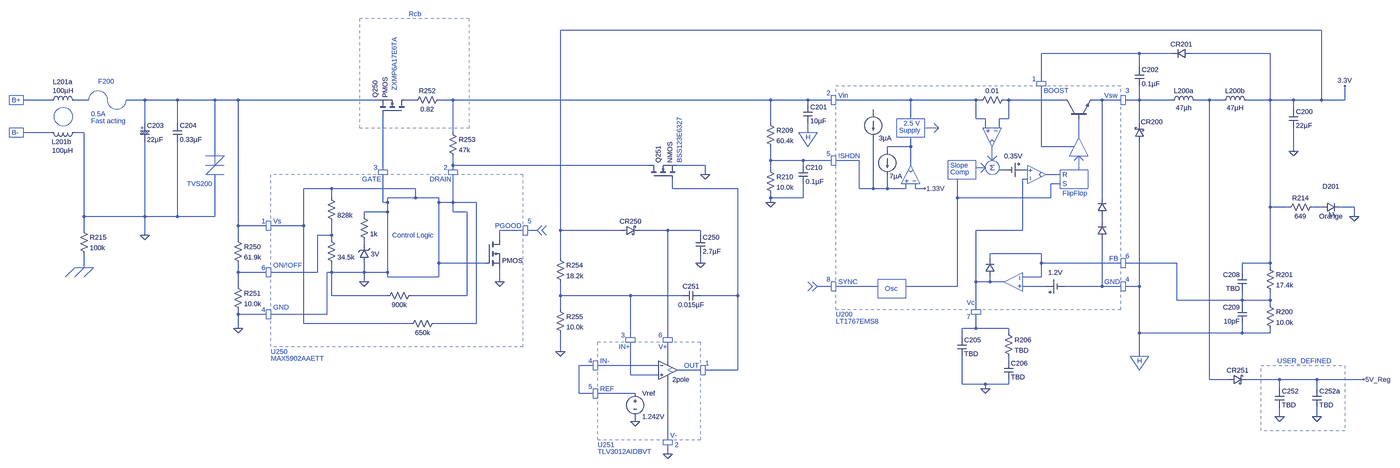
[diagram p0: schematic SPS_rev2_2.asc, whole sheet]
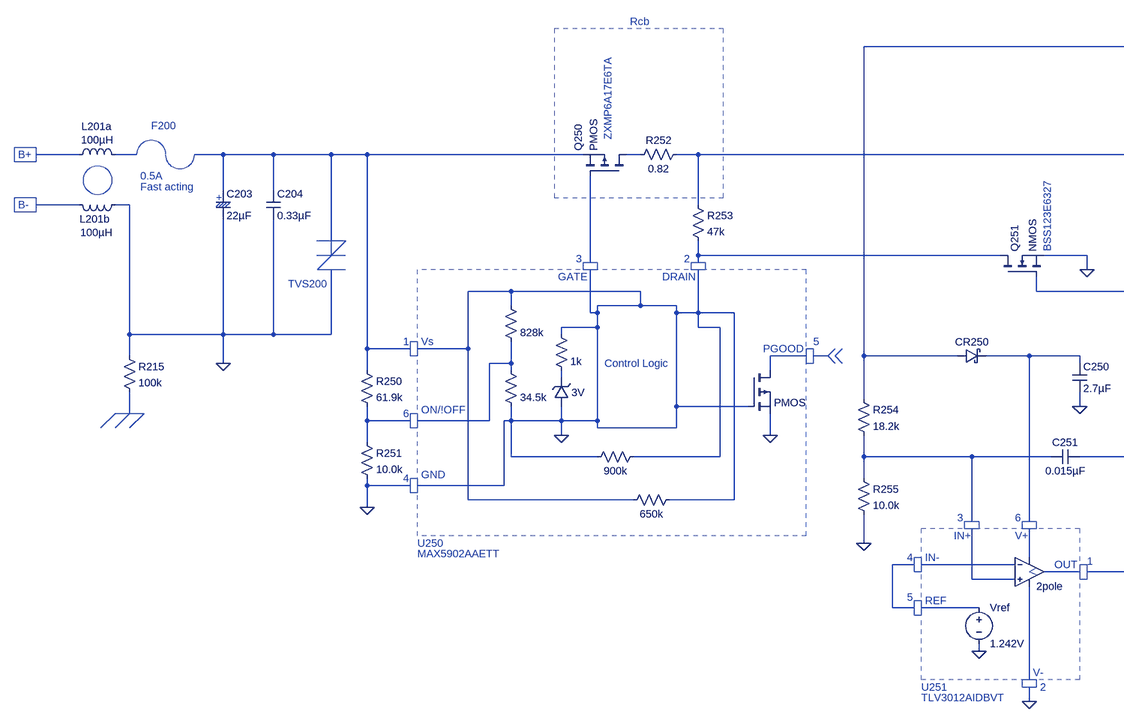
[diagram p1: schematic SPS_rev2_2.asc, part, row 1 of 1, column 1 of 2]
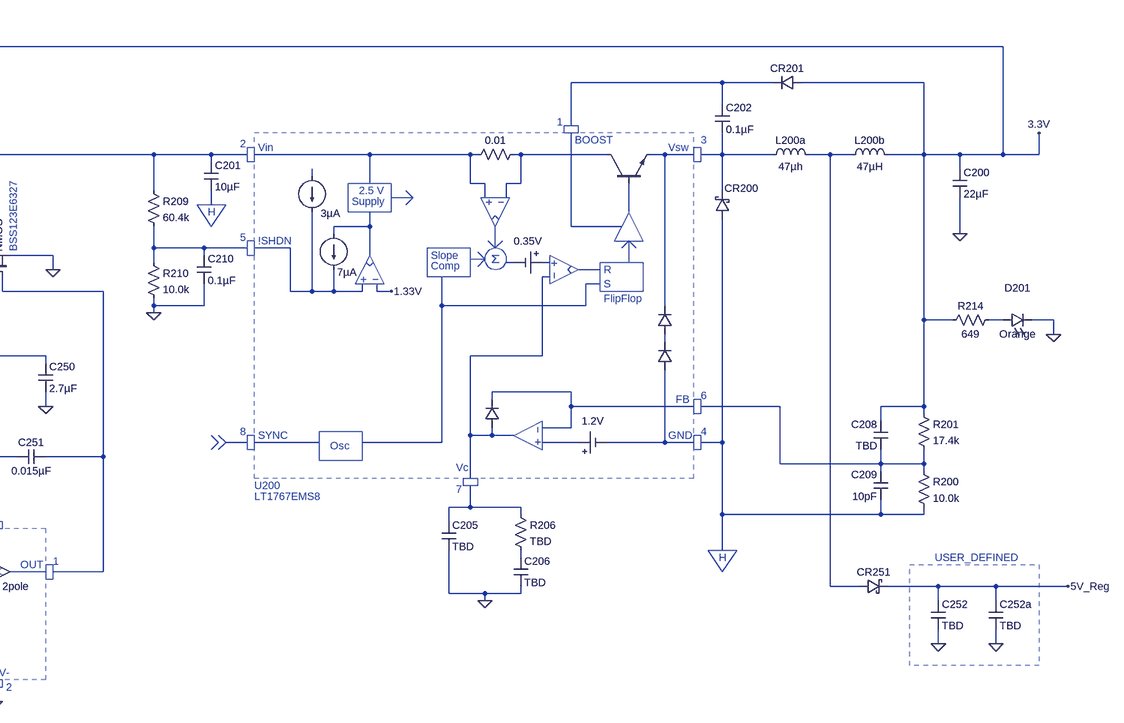
[diagram p2: schematic SPS_rev2_2.asc, part, row 1 of 1, column 2 of 2]
SPS_rev2_2.asc, the LTspice schematic file:
Version 4
SHEET 1 3524 1044
WIRE -1088 -416 -1184 -416
WIRE -1088 -304 -1184 -304
WIRE -976 -304 -1008 -304
WIRE -976 -16 -976 -304
WIRE -976 32 -976 -16
WIRE -976 160 -976 112
WIRE -960 -416 -1008 -416
WIRE -768 -416 -832 -416
WIRE -768 -336 -768 -416
WIRE -768 -16 -976 -16
WIRE -768 -16 -768 -272
WIRE -768 48 -768 -16
WIRE -656 -416 -768 -416
WIRE -656 -336 -656 -416
WIRE -656 -16 -768 -16
WIRE -656 -16 -656 -272
WIRE -528 -416 -656 -416
WIRE -528 -224 -528 -416
WIRE -528 -16 -656 -16
WIRE -528 -16 -528 -160
WIRE -448 -416 -528 -416
WIRE -448 16 -448 -416
WIRE -448 64 -448 16
WIRE -448 176 -448 144
WIRE -448 224 -448 176
WIRE -448 320 -448 304
WIRE -448 368 -448 320
WIRE -352 16 -448 16
WIRE -352 176 -448 176
WIRE -352 320 -448 320
WIRE -224 16 -336 16
WIRE -224 16 -224 -112
WIRE -224 352 -224 16
WIRE -176 176 -336 176
WIRE -176 176 -176 48
WIRE -144 320 -336 320
WIRE -144 320 -144 176
WIRE -128 -112 -224 -112
WIRE -128 -80 -128 -112
WIRE -128 48 -176 48
WIRE -128 48 -128 0
WIRE -128 64 -128 48
WIRE -128 176 -144 176
WIRE -128 176 -128 144
WIRE -128 256 -128 176
WIRE -16 -16 -16 -32
WIRE -16 80 -16 64
WIRE -16 176 -128 176
WIRE -16 176 -16 144
WIRE -16 208 -16 176
WIRE 32 -416 -448 -416
WIRE 48 -176 48 -368
WIRE 48 -64 48 -160
WIRE 64 -64 48 -64
WIRE 64 -64 64 -80
WIRE 64 -32 -16 -32
WIRE 64 -32 64 -64
WIRE 64 176 -16 176
WIRE 64 176 64 -32
WIRE 64 192 64 176
WIRE 64 256 -128 256
WIRE 144 352 -224 352
WIRE 160 -416 128 -416
WIRE 160 -112 -128 -112
WIRE 160 -80 64 -80
WIRE 160 -80 160 -112
WIRE 240 -80 160 -80
WIRE 240 -64 240 -80
WIRE 240 144 240 -64
WIRE 240 192 64 192
WIRE 240 192 240 144
WIRE 288 -416 240 -416
WIRE 288 -304 288 -416
WIRE 288 -192 288 -224
WIRE 288 -176 288 -192
WIRE 288 -64 240 -64
WIRE 288 -64 288 -160
WIRE 288 -32 288 -64
WIRE 336 -32 288 -32
WIRE 336 256 144 256
WIRE 336 256 336 -32
WIRE 368 -64 288 -64
WIRE 368 352 224 352
WIRE 368 352 368 -64
WIRE 400 144 240 144
WIRE 448 64 448 32
WIRE 448 208 448 160
WIRE 528 32 448 32
WIRE 576 32 544 32
WIRE 656 32 656 -656
WIRE 656 128 656 32
WIRE 656 256 656 208
WIRE 656 304 656 256
WIRE 656 448 656 384
WIRE 720 592 720 496
WIRE 768 496 720 496
WIRE 768 592 720 592
WIRE 864 32 656 32
WIRE 896 256 656 256
WIRE 896 400 896 256
WIRE 896 528 896 416
WIRE 912 592 784 592
WIRE 912 688 912 672
WIRE 960 -192 288 -192
WIRE 992 496 784 496
WIRE 992 528 896 528
WIRE 1024 32 928 32
WIRE 1024 400 1024 32
WIRE 1024 480 1024 416
WIRE 1024 752 1024 544
WIRE 1024 800 1024 768
WIRE 1040 -112 1040 -144
WIRE 1072 256 896 256
WIRE 1136 32 1024 32
WIRE 1136 48 1136 32
WIRE 1136 144 1136 112
WIRE 1136 512 1056 512
WIRE 1152 -192 1056 -192
WIRE 1152 -160 1152 -192
WIRE 1264 -112 1040 -112
WIRE 1264 256 1136 256
WIRE 1264 256 1264 -112
WIRE 1264 512 1152 512
WIRE 1264 512 1264 256
WIRE 1376 -416 288 -416
WIRE 1376 -336 1376 -416
WIRE 1376 -208 1376 -256
WIRE 1376 -176 1376 -208
WIRE 1376 -80 1376 -96
WIRE 1376 -64 1376 -80
WIRE 1488 -208 1376 -208
WIRE 1488 -192 1488 -208
WIRE 1488 -80 1376 -80
WIRE 1488 -80 1488 -128
WIRE 1504 -416 1376 -416
WIRE 1504 -400 1504 -416
WIRE 1504 -304 1504 -336
WIRE 1584 -416 1504 -416
WIRE 1584 -208 1488 -208
WIRE 1584 224 1536 224
WIRE 1680 -208 1600 -208
WIRE 1680 -112 1680 -208
WIRE 1728 -368 1728 -384
WIRE 1728 -112 1680 -112
WIRE 1728 -112 1728 -288
WIRE 1744 224 1600 224
WIRE 1776 -240 1776 -256
WIRE 1776 -112 1728 -112
WIRE 1776 -112 1776 -160
WIRE 1840 -112 1776 -112
WIRE 1840 -112 1840 -128
WIRE 1856 -416 1600 -416
WIRE 1856 -352 1856 -416
WIRE 1856 -256 1776 -256
WIRE 1856 -256 1856 -288
WIRE 1856 -192 1856 -256
WIRE 1872 -112 1872 -128
WIRE 1904 -112 1872 -112
WIRE 2016 -80 2016 -144
WIRE 2016 224 1840 224
WIRE 2016 224 2016 -80
WIRE 2032 400 2032 368
WIRE 2032 560 2032 464
WIRE 2080 -416 1856 -416
WIRE 2080 -352 2080 -416
WIRE 2080 208 2080 32
WIRE 2080 304 2080 208
WIRE 2080 368 2032 368
WIRE 2080 368 2080 320
WIRE 2096 -416 2080 -416
WIRE 2112 -352 2080 -352
WIRE 2112 -320 2112 -352
WIRE 2112 560 2032 560
WIRE 2112 576 2112 560
WIRE 2128 128 2128 112
WIRE 2128 208 2080 208
WIRE 2128 208 2128 192
WIRE 2160 -320 2160 -352
WIRE 2176 -176 2160 -176
WIRE 2176 208 2128 208
WIRE 2192 -416 2176 -416
WIRE 2192 -352 2160 -352
WIRE 2192 -352 2192 -416
WIRE 2192 368 2080 368
WIRE 2192 384 2192 368
WIRE 2192 480 2192 464
WIRE 2192 560 2112 560
WIRE 2192 560 2192 544
WIRE 2240 32 2080 32
WIRE 2240 32 2240 -144
WIRE 2256 -176 2240 -176
WIRE 2256 -144 2240 -144
WIRE 2304 -480 2304 -576
WIRE 2304 -256 2304 -464
WIRE 2304 112 2128 112
WIRE 2304 144 2304 112
WIRE 2304 192 2240 192
WIRE 2304 192 2304 144
WIRE 2320 224 2240 224
WIRE 2336 -80 2016 -80
WIRE 2336 -80 2336 -128
WIRE 2368 -160 2320 -160
WIRE 2368 -128 2336 -128
WIRE 2384 -416 2192 -416
WIRE 2416 -256 2304 -256
WIRE 2432 -288 2432 -352
WIRE 2512 -416 2480 -416
WIRE 2512 -80 2512 -416
WIRE 2512 0 2512 -16
WIRE 2512 224 2384 224
WIRE 2512 224 2512 64
WIRE 2576 -416 2512 -416
WIRE 2576 144 2304 144
WIRE 2576 224 2512 224
WIRE 2640 -576 2304 -576
WIRE 2640 -528 2640 -576
WIRE 2640 -416 2592 -416
WIRE 2640 -416 2640 -464
WIRE 2640 -336 2640 -416
WIRE 2640 224 2592 224
WIRE 2640 224 2640 -272
WIRE 2640 384 2640 224
WIRE 2640 464 2640 384
WIRE 2752 -576 2640 -576
WIRE 2752 -416 2640 -416
WIRE 2768 144 2592 144
WIRE 2768 272 2768 144
WIRE 2880 -416 2832 -416
WIRE 2880 544 2880 -416
WIRE 2928 -416 2880 -416
WIRE 2944 544 2880 544
WIRE 2992 176 2992 144
WIRE 2992 272 2768 272
WIRE 2992 272 2992 240
WIRE 2992 288 2992 272
WIRE 2992 384 2640 384
WIRE 2992 384 2992 352
WIRE 3088 -576 2816 -576
WIRE 3088 -416 3008 -416
WIRE 3088 -416 3088 -576
WIRE 3088 -48 3088 -416
WIRE 3088 144 2992 144
WIRE 3088 144 3088 -48
WIRE 3088 160 3088 144
WIRE 3088 272 2992 272
WIRE 3088 272 3088 240
WIRE 3088 288 3088 272
WIRE 3088 384 2992 384
WIRE 3088 384 3088 368
WIRE 3120 544 3008 544
WIRE 3120 576 3120 544
WIRE 3120 672 3120 640
WIRE 3152 -48 3088 -48
WIRE 3168 -416 3088 -416
WIRE 3168 -384 3168 -416
WIRE 3168 -240 3168 -320
WIRE 3248 544 3120 544
WIRE 3248 576 3248 544
WIRE 3248 672 3248 640
WIRE 3264 -656 656 -656
WIRE 3264 -416 3168 -416
WIRE 3264 -416 3264 -656
WIRE 3264 -48 3232 -48
WIRE 3344 -416 3264 -416
WIRE 3344 -416 3344 -464
WIRE 3376 -48 3328 -48
WIRE 3376 -16 3376 -48
WIRE 3408 544 3248 544
FLAG -448 368 0
FLAG 656 448 0
FLAG 1152 -160 0
FLAG 1136 144 0
FLAG 1024 800 0
FLAG 1376 -64 0
FLAG 2112 576 0
FLAG 3168 -240 0
FLAG 3344 -464 3.3V
FLAG 448 208 0
FLAG -16 208 0
FLAG 912 688 0
FLAG 1904 -112 1.33V
FLAG 3376 -16 0
FLAG 3120 672 0
FLAG 3408 544 5V_Reg
FLAG -768 48 0
FLAG 3248 672 0
SYMBOL ind -1104 -400 R270
WINDOW 0 63 55 VTop 0
WINDOW 3 64 56 VBottom 0
SYMATTR InstName L201a
SYMATTR Value 100µH
SYMBOL ind -992 -320 R90
WINDOW 0 63 61 VBottom 0
WINDOW 3 62 58 VTop 0
SYMATTR InstName L201b
SYMATTR Value 100µH
SYMBOL cap -672 -336 R0
SYMATTR InstName C204
SYMATTR Value 0.33µF
SYMBOL cap -784 -336 R0
SYMATTR InstName C203
SYMATTR Value 22µF
SYMBOL res -992 16 R0
SYMATTR InstName R215
SYMATTR Value 100k
SYMBOL res 1360 -192 R0
SYMATTR InstName R210
SYMATTR Value 10.0k
SYMBOL res 1360 -352 R0
SYMATTR InstName R209
SYMATTR Value 60.4k
SYMBOL cap 1472 -192 R0
SYMATTR InstName C210
SYMATTR Value 0.1µF
SYMBOL res 2176 368 R0
SYMATTR InstName R206
SYMATTR Value TBD
SYMBOL cap 2016 400 R0
SYMATTR InstName C205
SYMATTR Value TBD
SYMBOL cap 2176 480 R0
SYMATTR InstName C206
SYMATTR Value TBD
SYMBOL ind 2736 -400 R270
WINDOW 0 32 56 VTop 0
WINDOW 3 5 56 VBottom 0
SYMATTR InstName L200a
SYMATTR Value 47µh
SYMBOL cap 2624 -528 R0
SYMATTR InstName C202
SYMATTR Value 0.1µF
SYMBOL diode 2816 -560 M270
WINDOW 0 32 32 VTop 0
WINDOW 3 0 32 VBottom 0
SYMATTR InstName CR201
SYMATTR Value ""
SYMBOL cap 3152 -384 R0
SYMATTR InstName C200
SYMATTR Value 22µF
SYMBOL res 3072 144 R0
SYMATTR InstName R201
SYMATTR Value 17.4k
SYMBOL res 3072 272 R0
SYMATTR InstName R200
SYMATTR Value 10.0k
SYMBOL cap 3008 176 M0
SYMATTR InstName C208
SYMATTR Value TBD
SYMBOL cap 3008 288 M0
SYMATTR InstName C209
SYMATTR Value 10pF
SYMBOL schottky 2656 -272 R180
WINDOW 0 -64 69 Left 0
WINDOW 3 24 0 Left 0
SYMATTR InstName CR200
SYMATTR Value ""
SYMBOL pmos 400 64 R0
SYMBOL res 48 272 R270
WINDOW 0 32 56 VTop 0
WINDOW 3 0 56 VBottom 0
SYMATTR Value 900k
SYMBOL res 128 368 R270
WINDOW 0 32 56 VTop 0
WINDOW 3 0 56 VBottom 0
SYMATTR Value 650k
SYMBOL res -32 -32 R0
SYMATTR Value 1k
SYMBOL zener 0 144 R180
WINDOW 0 24 72 Left 0
WINDOW 3 -36 31 Left 0
SYMATTR Value 3V
SYMBOL res -144 -96 R0
SYMATTR Value 828k
SYMBOL res -144 48 R0
SYMATTR Value 34.5k
SYMBOL voltage 912 576 R0
SYMATTR InstName Vref
SYMATTR Value 1.242V
SYMBOL Opamps\\2pole 1024 512 R0
SYMBOL npn 2384 -352 R270
SYMATTR Value ""
SYMBOL current 1728 -368 R0
WINDOW 3 19 83 Left 0
SYMATTR Value 3µA
SYMBOL current 1776 -240 R0
WINDOW 3 8 86 Left 0
WINDOW 123 0 0 Left 0
WINDOW 39 0 0 Left 0
SYMATTR Value 7µA
SYMBOL res 2192 -432 R90
WINDOW 0 0 56 VBottom 0
WINDOW 3 32 56 VTop 0
SYMATTR InstName 0.01
SYMATTR Value ""
SYMBOL Misc\\cell 2240 -176 R90
WINDOW 0 -32 32 VBottom 0
WINDOW 3 32 32 VTop 0
SYMATTR InstName 0.35V
SYMATTR Value ""
SYMBOL Misc\\cell 2320 224 R270
WINDOW 0 32 32 VTop 0
WINDOW 3 -32 32 VBottom 0
SYMATTR InstName 1.2V
SYMATTR Value ""
SYMBOL diode 2112 192 M180
WINDOW 0 24 72 Left 0
WINDOW 3 24 0 Left 0
SYMATTR Value ""
SYMBOL diode 2528 -16 R180
WINDOW 0 24 72 Left 0
WINDOW 3 24 0 Left 0
SYMATTR Value ""
SYMBOL diode 2528 64 R180
WINDOW 0 24 72 Left 0
WINDOW 3 24 0 Left 0
SYMATTR Value ""
SYMBOL cap 1488 -400 R0
SYMATTR InstName C201
SYMATTR Value 10µF
SYMBOL ind 2912 -400 R270
WINDOW 0 32 56 VTop 0
WINDOW 3 5 56 VBottom 0
SYMATTR InstName L200b
SYMATTR Value 47µH
SYMBOL cap 3104 576 R0
SYMATTR InstName C252
SYMATTR Value TBD
SYMBOL schottky 2944 560 R270
WINDOW 0 32 32 VTop 0
WINDOW 3 0 32 VBottom 0
SYMATTR InstName CR251
SYMATTR Value ""
SYMBOL res 3136 -32 R270
WINDOW 0 32 56 VTop 0
WINDOW 3 0 56 VBottom 0
SYMATTR InstName R214
SYMATTR Value 649
SYMBOL res 640 288 R0
SYMATTR InstName R255
SYMATTR Value 10.0k
SYMBOL res 640 112 R0
SYMATTR InstName R254
SYMATTR Value 18.2k
SYMBOL res 272 -320 R0
SYMATTR InstName R253
SYMATTR Value 47k
SYMBOL res 144 -400 R270
WINDOW 0 32 56 VTop 0
WINDOW 3 0 56 VBottom 0
SYMATTR InstName R252
SYMATTR Value 0.82
SYMBOL res -464 48 R0
SYMATTR InstName R250
SYMATTR Value 61.9k
SYMBOL res -464 208 R0
SYMATTR InstName R251
SYMATTR Value 10.0k
SYMBOL schottky 864 48 R270
WINDOW 0 32 32 VTop 0
WINDOW 3 0 32 VBottom 0
SYMATTR InstName CR250
SYMATTR Value ""
SYMBOL pmos 128 -368 M270
WINDOW 0 56 106 Left 0
SYMATTR InstName Q250
SYMBOL nmos 960 -144 R270
SYMATTR InstName Q251
SYMBOL cap 1072 272 R270
WINDOW 0 32 32 VTop 0
WINDOW 3 0 32 VBottom 0
SYMATTR InstName C251
SYMATTR Value 0.015µF
SYMBOL cap 1120 48 R0
SYMATTR InstName C250
SYMATTR Value 2.7µF
SYMBOL LED 3264 -32 R270
WINDOW 0 72 32 VTop 0
WINDOW 3 0 32 VBottom 0
SYMATTR InstName D201
SYMATTR Value Orange
SYMBOL cap 3232 576 R0
SYMATTR InstName C252a
SYMATTR Value TBD
TEXT -328 0 Left 0 ;Vs
TEXT -328 152 Left 0 ;ON/!OFF
TEXT -24 -144 Left 0 ;GATE
TEXT 208 -144 Left 0 ;DRAIN
TEXT -328 296 Left 0 ;GND
TEXT 432 16 Left 0 ;PGOOD
TEXT -336 472 Left 0 ;MAX5902AAETT
TEXT 784 792 Left 0 ;TLV3012AIDBVT
TEXT 856 432 Left 0 ;IN+
TEXT 792 480 Left 0 ;IN-
TEXT 1080 496 Left 0 ;OUT
TEXT 1032 736 Left 0 ;V-
TEXT 992 432 Left 0 ;V+
TEXT 1608 -432 Left 0 ;Vin
TEXT 1608 -224 Left 0 ;!SHDN
TEXT 2312 -448 Left 0 ;BOOST
TEXT 1608 208 Left 0 ;SYNC
TEXT 2520 -432 Left 0 ;Vsw
TEXT 1600 344 Left 0 ;LT1767EMS8
TEXT 2048 280 Left 0 ;Vc
TEXT 2536 128 Left 0 ;FB
TEXT 2520 208 Left 0 ;GND
TEXT 80 48 Left 0 ;Control Logic
TEXT -368 0 Left 0 ;1
TEXT -368 160 Left 0 ;6
TEXT -368 304 Left 0 ;4
TEXT 16 -184 Left 0 ;3
TEXT 256 -184 Left 0 ;2
TEXT 544 0 Left 0 ;5
TEXT 792 576 Left 0 ;REF
TEXT 864 392 Left 0 ;3
TEXT 992 392 Left 0 ;6
TEXT 752 480 Left 0 ;4
TEXT 752 568 Left 0 ;5
TEXT 1048 768 Left 0 ;2
TEXT 1152 488 Left 0 ;1
TEXT 1832 -336 Left 0 ;2.5 V
TEXT 1816 -312 Left 0 ;Supply
TEXT 1768 232 Left 0 ;Osc
TEXT 1992 -192 Left 0 ;Slope
TEXT 1992 -168 Left 0 ;Comp
TEXT 2376 -160 Left 0 ;R
TEXT 2376 -128 Left 0 ;S
TEXT 2376 -96 Left 0 ;FlipFlop
TEXT 1568 -440 Left 0 ;2
TEXT 1568 -232 Left 0 ;5
TEXT 1568 200 Left 0 ;8
TEXT 2048 328 Left 0 ;7
TEXT 2592 200 Left 0 ;4
TEXT 2592 120 Left 0 ;6
TEXT 2592 -448 Left 0 ;3
TEXT 2272 -488 Left 0 ;1
TEXT -784 -320 Left 0 ;+
TEXT -624 -128 Left 0 ;TVS200
TEXT 1496 -288 Left 0 ;H
TEXT 2632 480 Left 0 ;H
TEXT -1224 -416 Left 0 ;B+
TEXT -1224 -304 Left 0 ;B-
TEXT -928 -480 Left 0 ;F200
TEXT -952 -368 Left 0 ;0.5A
TEXT -952 -344 Left 0 ;Fast acting
TEXT 1600 320 Left 0 ;U200
TEXT -336 448 Left 0 ;U250
TEXT 784 768 Left 0 ;U251
TEXT 1080 -280 VBottom 0 ;BSS123E6327
TEXT 88 -632 VRight 0 ;ZXMP6A17E6TA
TEXT 136 -712 Left 0 ;Rcb
TEXT 3112 480 Left 0 ;USER_DEFINED
LINE Normal 528 -160 -336 -160 2
LINE Normal -336 432 -336 -160 2
LINE Normal 1136 416 784 416 2
LINE Normal 784 752 784 416 2
LINE Normal 1039 503 1024 512
LINE Normal 1024 512 1041 519
LINE Normal 1856 -192 1856 -192
LINE Normal 1824 -128 1856 -192
LINE Normal 1856 -192 1888 -128
LINE Normal 1888 -128 1824 -128
LINE Normal 1856 -168 1848 -176
LINE Normal 1856 -168 1864 -176
LINE Normal 1952 -320 1904 -320
LINE Normal 1952 -320 1952 -320
LINE Normal 1936 -336 1952 -320
LINE Normal 1936 -336 1936 -336
LINE Normal 1952 -320 1936 -304
LINE Normal 1842 -144 1842 -144
LINE Normal 1842 -132 1842 -144
LINE Normal 1836 -138 1848 -138
LINE Normal 1863 -138 1875 -138
LINE Normal 2320 -160 2320 -160
LINE Normal 2256 -192 2320 -160
LINE Normal 2320 -160 2256 -128
LINE Normal 2256 -128 2256 -192
LINE Normal 2296 -160 2304 -168
LINE Normal 2296 -160 2304 -152
LINE Normal 2272 -174 2272 -174
LINE Normal 2260 -174 2272 -174
LINE Normal 2266 -180 2266 -168
LINE Normal 2266 -153 2266 -141
LINE Normal 2135 -256 2135 -256
LINE Normal 2103 -320 2135 -256
LINE Normal 2135 -256 2167 -320
LINE Normal 2167 -320 2103 -320
LINE Normal 2135 -280 2127 -272
LINE Normal 2135 -280 2143 -272
LINE Normal 2121 -304 2121 -304
LINE Normal 2121 -316 2121 -304
LINE Normal 2115 -310 2127 -310
LINE Normal 2142 -310 2154 -310
LINE Normal 2020 -208 2020 -208
LINE Normal 2128 -192 2144 -192
LINE Normal 2128 -192 2128 -192
LINE Normal 2136 -185 2128 -192
LINE Normal 2136 -185 2136 -185
LINE Normal 2128 -176 2136 -185
LINE Normal 2128 -176 2128 -176
LINE Normal 2144 -176 2128 -176
LINE Normal 2112 -183 2112 -183
LINE Normal 2096 -199 2112 -183
LINE Normal 2096 -199 2096 -199
LINE Normal 2112 -183 2096 -167
LINE Normal 2135 -208 2135 -256
LINE Normal 2135 -208 2135 -208
LINE Normal 2151 -224 2135 -208
LINE Normal 2151 -224 2151 -224
LINE Normal 2135 -208 2119 -224
LINE Normal 2081 -183 2112 -183
LINE Normal 2412 -176 2412 -176
LINE Normal 2432 -287 2432 -287
LINE Normal 2400 -223 2432 -287
LINE Normal 2432 -287 2464 -223
LINE Normal 2464 -223 2400 -223
LINE Normal 2432 -176 2432 -176
LINE Normal 2432 -224 2432 -176
LINE Normal 2432 -224 2432 -224
LINE Normal 2416 -208 2432 -224
LINE Normal 2416 -208 2416 -208
LINE Normal 2432 -224 2448 -208
LINE Normal 2176 209 2176 209
LINE Normal 2240 241 2176 209
LINE Normal 2176 209 2240 177
LINE Normal 2240 177 2240 241
LINE Normal 2224 223 2224 223
LINE Normal 2236 223 2224 223
LINE Normal 2230 229 2230 217
LINE Normal 2230 202 2230 190
LINE Normal 1600 304 1600 -464 2
LINE Normal 2576 -464 1600 -464 2
LINE Normal -777 -300 -768 -308
LINE Normal -777 -300 -777 -300
LINE Normal -763 -300 -754 -308
LINE Normal -784 -300 -775 -308
LINE Normal -770 -300 -761 -308
LINE Normal -495 -224 -560 -224
LINE Normal -495 -224 -495 -224
LINE Normal -559 -160 -495 -224
LINE Normal -559 -160 -559 -160
LINE Normal -496 -160 -559 -160
LINE Normal -496 -160 -496 -160
LINE Normal -496 -192 -560 -192
LINE Normal -528 -192 -528 -224
LINE Normal 1536 -304 1472 -304
LINE Normal 1536 -304 1536 -304
LINE Normal 1504 -256 1536 -304
LINE Normal 1504 -256 1504 -256
LINE Normal 1472 -304 1504 -256
LINE Normal 2672 464 2608 464
LINE Normal 2672 464 2672 464
LINE Normal 2640 512 2672 464
LINE Normal 2640 512 2640 512
LINE Normal 2608 464 2640 512
LINE Normal -944 160 -1008 160
LINE Normal -944 160 -944 160
LINE Normal -976 192 -944 160
LINE Normal -1008 192 -976 160
LINE Normal -1040 192 -1008 160
LINE Normal 1520 208 1536 224
LINE Normal 1504 208 1520 224
LINE Normal 1520 224 1504 240
LINE Normal 1536 224 1520 240
LINE Normal 528 432 -336 432 2
LINE Normal 528 432 528 -160 2
LINE Normal 1136 752 784 752 2
LINE Normal 1136 752 1136 416 2
LINE Normal 2576 304 2576 -464 2
LINE Normal 2576 304 1600 304 2
LINE Normal 592 48 576 32
LINE Normal 608 48 592 32
LINE Normal 592 32 608 16
LINE Normal 576 32 592 16
RECTANGLE Normal 1904 -288 1808 -352
RECTANGLE Normal 1840 264 1744 200
RECTANGLE Normal 2080 -144 1984 -208
RECTANGLE Normal 2464 -112 2368 -176
RECTANGLE Normal -1232 -288 -1184 -320
RECTANGLE Normal -1232 -400 -1184 -432
RECTANGLE Normal 64 -160 32 -176
RECTANGLE Normal -352 32 -336 0
RECTANGLE Normal 768 512 784 480
RECTANGLE Normal 880 400 912 416
RECTANGLE Normal 1584 240 1600 208
RECTANGLE Normal 2064 304 2096 320
RECTANGLE Normal -352 192 -336 160
RECTANGLE Normal -352 336 -336 304
RECTANGLE Normal 304 -160 272 -176
RECTANGLE Normal 528 48 544 16
RECTANGLE Normal 1584 -192 1600 -224
RECTANGLE Normal 1584 -400 1600 -432
RECTANGLE Normal 2576 -400 2592 -432
RECTANGLE Normal 2576 160 2592 128
RECTANGLE Normal 2576 240 2592 208
RECTANGLE Normal 2288 -480 2320 -464
RECTANGLE Normal 768 608 784 576
RECTANGLE Normal 1136 528 1152 496
RECTANGLE Normal 1008 400 1040 416
RECTANGLE Normal 1008 752 1040 768
RECTANGLE Normal 344 -696 -32 -320 1
RECTANGLE Normal 3344 720 3056 496 1
CIRCLE Normal 2160 -160 2112 -208
CIRCLE Normal -1015 -327 -1079 -391
ARC Normal -896 -384 -960 -448 -895 -417 -959 -417
ARC Normal -896 -448 -832 -384 -897 -415 -833 -415

The netlist it stands for:
* SPS_rev2_2.asc
L201a N001 N004 100µH
L201b 0 N002 100µH
C204 N005 0 0.33µF
C203 N005 0 22µF
R215 0 N003 100k
R210 N025 0 10.0k
R209 N011 N025 60.4k
C210 N025 0 0.1µF
R206 N034 N039 TBD
C205 N034 0 TBD
C206 N039 0 TBD
L200a N049 N052 47µh
C202 N041 N049 0.1µF
D§CR201 3.3V N041
C200 3.3V 0 22µF
R201 3.3V N051 17.4k
R200 N051 N050 10.0k
C208 3.3V N051 TBD
C209 N051 N050 10pF
D§CR200 N050 N049
M§? N013 0 0 0 PMOS
R§? 0 0 900k
R§? 0 0 650k
R§? 0 N008 1k
D§? 0 N008 3V
R§? 0 N007 828k
R§? N007 0 34.5k
Vref N018 0 1.242V
* ?: 2pole (symbol Opamps\2pole not available, pins judged from their places): In+=N017 In-=N019 V+=N021 V-=N022 OUT=N024
Q§? N037 N045 N046 0
I§? N029 N028 3µA
I§? N031 N028 7µA
R§0.01 N037 N032
V§0.35V N040 N038
V§1.2V N043 N048
D§? N035 N036
D§? N047 N046
D§? N048 N047
C201 N011 N026 10µF
L200b N052 3.3V 47µH
C252 5V_Reg 0 TBD
D§CR251 N052 5V_Reg
R214 3.3V N053 649
R255 N015 0 10.0k
R254 3.3V N015 18.2k
R253 N011 N012 47k
R252 N010 N011 0.82
R250 N005 N006 61.9k
R251 N006 0 10.0k
D§CR250 3.3V N020
M§Q250 N010 N009 N005 N005 PMOS
M§Q251 N012 N023 0 0 NMOS
C251 N015 N023 0.015µF
C250 N020 0 2.7µF
D201 N053 0 Orange
C252a 5V_Reg 0 TBD
.model D D
.lib standard.dio
.model NPN NPN
.model PNP PNP
.lib standard.bjt
.model NMOS NMOS
.model PMOS PMOS
.lib standard.mos
* Vs
* ON/!OFF
* GATE
* DRAIN
* GND
* PGOOD
* MAX5902AAETT
* TLV3012AIDBVT
* IN+
* IN-
* OUT
* V-
* V+
* Vin
* !SHDN
* BOOST
* SYNC
* Vsw
* LT1767EMS8
* Vc
* FB
* GND
* Control Logic
* 1
* 6
* 4
* 3
* 2
* 5
* REF
* 3
* 6
* 4
* 5
* 2
* 1
* 2.5 V
* Supply
* Osc
* Slope
* Comp
* R
* S
* FlipFlop
* 2
* 5
* 8
* 7
* 4
* 6
* 3
* 1
* +
* TVS200
* H
* H
* B+
* B-
* F200
* 0.5A
* Fast acting
* U200
* U250
* U251
* BSS123E6327
* ZXMP6A17E6TA
* Rcb
* USER_DEFINED
.backanno
.end